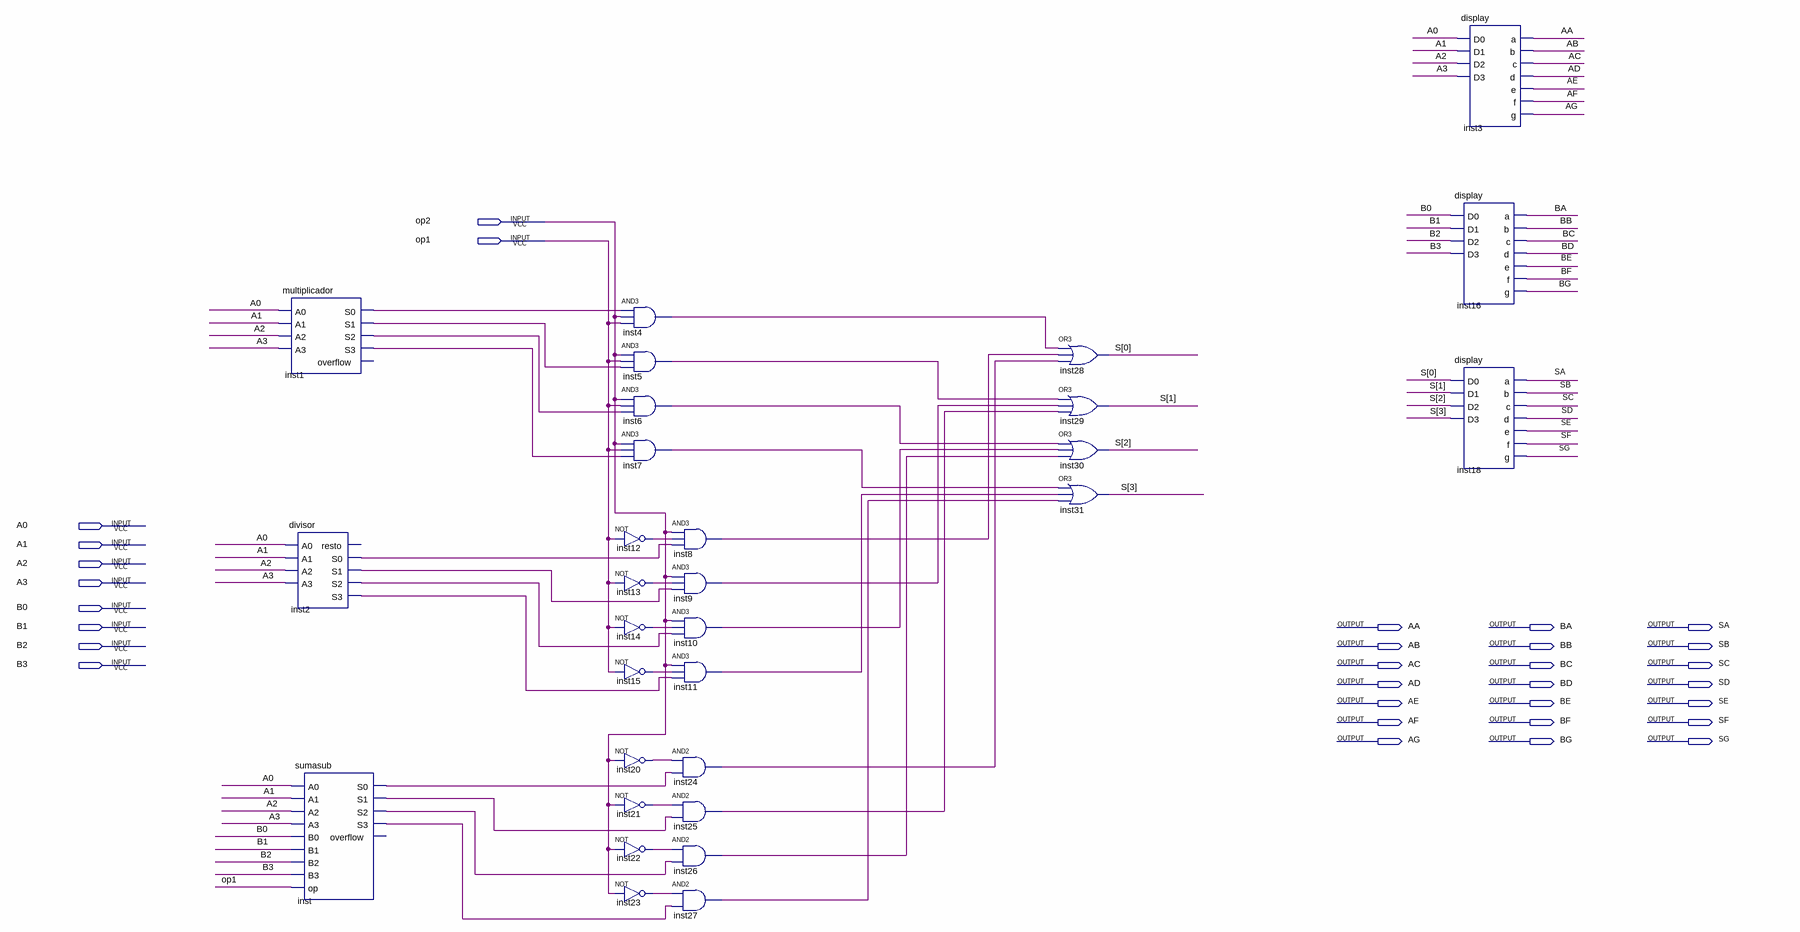
[diagram p0: schematic sheet]
// Quartus schematic ULA.bdf as structural Verilog: 30 symbols, 31 pins
module ULA (
  input  op2,
  input  op1,
  input  A0,
  input  A1,
  input  A2,
  input  A3,
  input  B0,
  input  B1,
  input  B2,
  input  B3,
  output AA,
  output BA,
  output SA,
  output AB,
  output BB,
  output SB,
  output AC,
  output BC,
  output SC,
  output AD,
  output BD,
  output SD,
  output AE,
  output BE,
  output SE,
  output AF,
  output BF,
  output SF,
  output AG,
  output BG,
  output SG
);

  wire inst1_s0, inst1_s1, inst1_s2, inst1_s3, inst2_s0, inst2_s1, inst2_s2, inst2_s3, inst4_out, inst5_out,
       inst6_out, inst7_out, inst8_out, inst9_out, inst10_out, inst11_out, inst12_out, inst13_out,
       inst14_out, inst15_out, inst20_out, inst21_out, inst22_out, inst23_out, inst24_out, inst25_out,
       inst26_out, inst27_out, inst_s0, inst_s1, inst_s2, inst_s3;
  wire [3:0] S;

  multiplicador inst1 (
    .A0(A0), .A1(A1), .A2(A2), .A3(A3), .S0(inst1_s0), .S1(inst1_s1), .S2(inst1_s2), .S3(inst1_s3));  // open: overflow
  divisor inst2 (
    .A0(A0), .A1(A1), .A2(A2), .A3(A3), .S0(inst2_s0), .S1(inst2_s1), .S2(inst2_s2), .S3(inst2_s3));  // open: resto
  sumasub inst (
    .A0(A0), .A1(A1), .A2(A2), .A3(A3), .B0(B0), .B1(B1), .B2(B2), .B3(B3), .op(op1), .S0(inst_s0),
    .S1(inst_s1), .S2(inst_s2), .S3(inst_s3));  // open: overflow
  and inst4 (inst4_out, inst1_s0, op2, op1);
  and inst5 (inst5_out, op2, op1, inst1_s1);
  and inst6 (inst6_out, op2, op1, inst1_s2);
  and inst7 (inst7_out, op2, op1, inst1_s3);
  not inst12 (inst12_out, op1);
  not inst13 (inst13_out, op1);
  not inst14 (inst14_out, op1);
  not inst15 (inst15_out, op1);
  not inst20 (inst20_out, op2);
  not inst21 (inst21_out, op2);
  not inst22 (inst22_out, op2);
  not inst23 (inst23_out, op2);
  and inst8 (inst8_out, op2, inst12_out, inst2_s0);
  and inst9 (inst9_out, op2, inst13_out, inst2_s1);
  and inst10 (inst10_out, op2, inst14_out, inst2_s2);
  and inst11 (inst11_out, op2, inst15_out, inst2_s3);
  and inst24 (inst24_out, inst20_out, inst_s0);
  and inst25 (inst25_out, inst21_out, inst_s1);
  and inst26 (inst26_out, inst22_out, inst_s2);
  and inst27 (inst27_out, inst23_out, inst_s3);
  or inst28 (S[0], inst4_out, inst8_out, inst24_out);
  or inst29 (S[1], inst5_out, inst9_out, inst25_out);
  or inst30 (S[2], inst6_out, inst10_out, inst26_out);
  or inst31 (S[3], inst7_out, inst11_out, inst27_out);
  display inst3 (.D0(A0), .D1(A1), .D2(A2), .D3(A3), .a(AA), .b(AB), .c(AC), .d(AD), .e(AE), .f(AF), .g(AG));
  display inst16 (.D0(B0), .D1(B1), .D2(B2), .D3(B3), .a(BA), .b(BB), .c(BC), .d(BD), .e(BE), .f(BF), .g(BG));
  display inst18 (.D0(S[0]), .D1(S[1]), .D2(S[2]), .D3(S[3]), .a(SA), .b(SB), .c(SC), .d(SD), .e(SE), .f(SF), .g(SG));
endmodule
